# Altium project IDE_44m_to_40f.PrjPcb
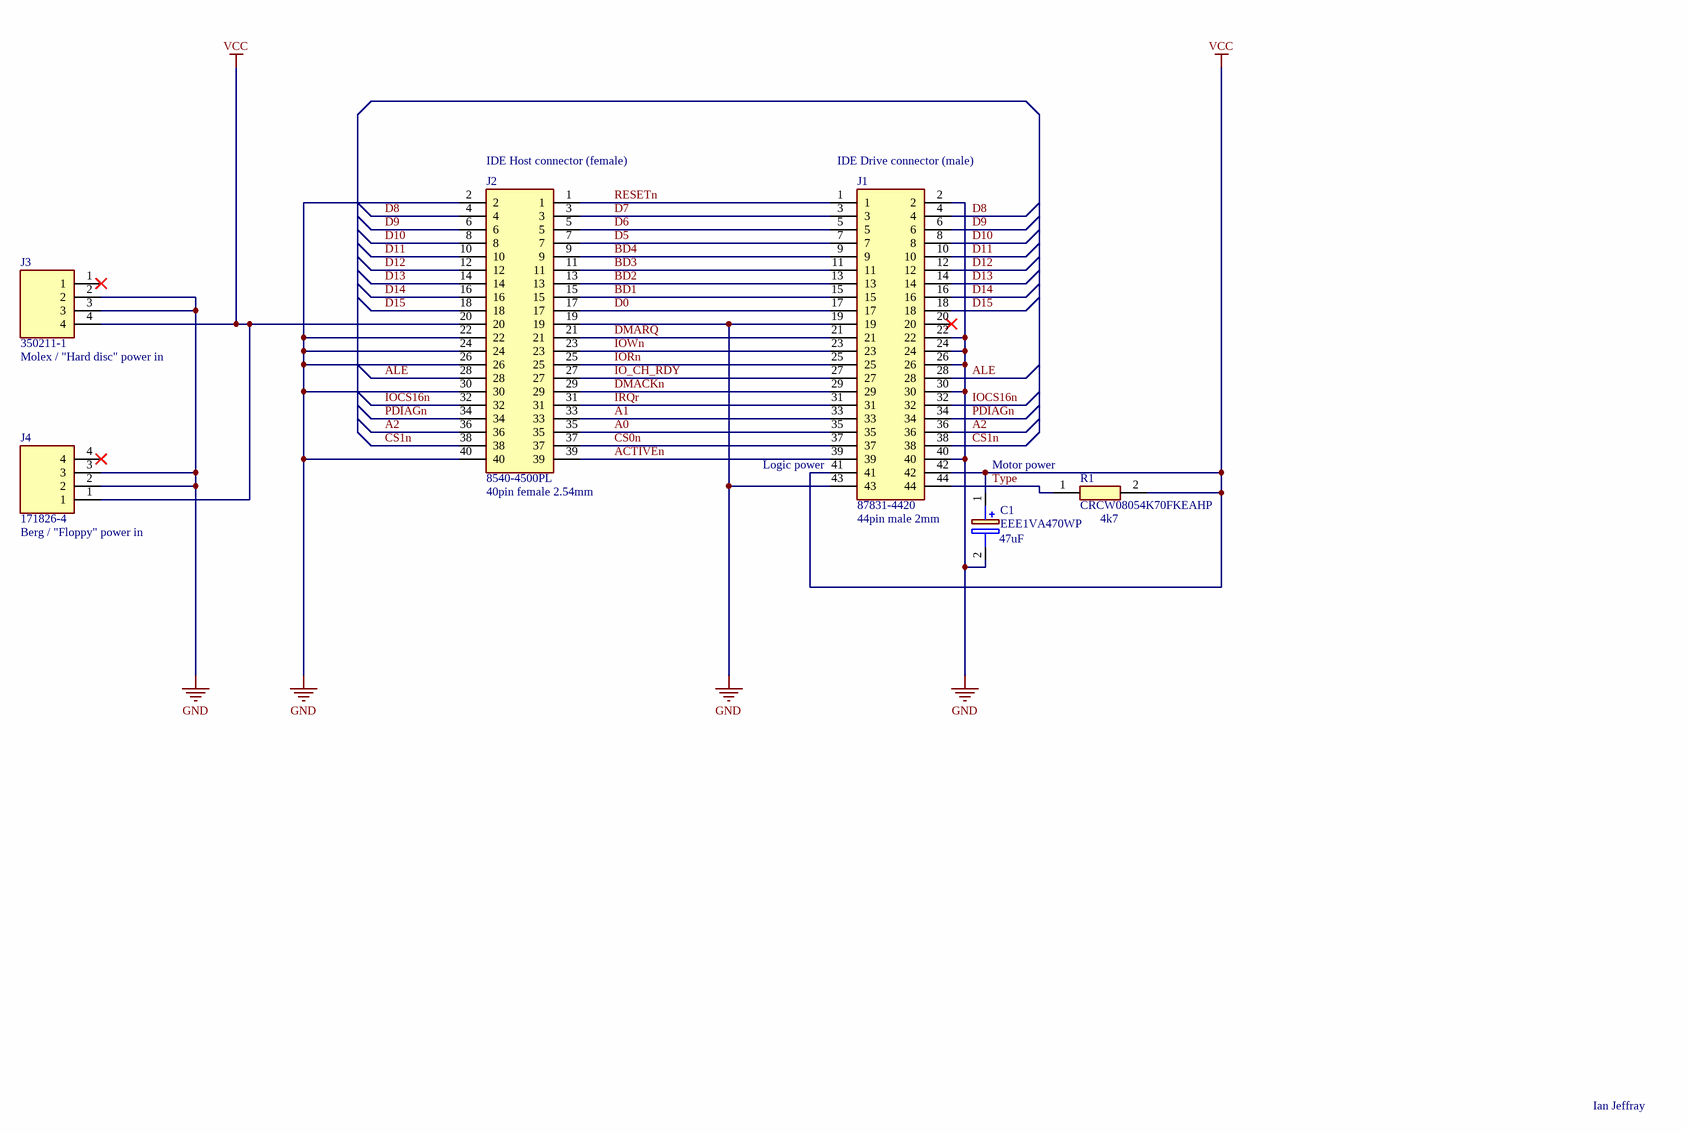
[diagram p0: IDE_44m_to_40f.SchDoc]
Project_Title: IDE 44male to 40female adapter; Sch_ReleaseDate: 20/02/2023; Sch_RevNo: 1
1 sheet, 6 parts. Net scope: global (net labels, ports and power ports of the same name join across sheets).
Board files: IDE_44m_to_40f_left.PcbDoc, IDE_44m_to_40f_right.PcbDoc

## Sheet IDE_44m_to_40f.SchDoc
size A3; SheetNumber: 1; SheetTotal: 1

### Parts
C1  EEE1VA470WP  value 47uF  [EEE1AA101SP]
J1  87831-4420  value 44pin male 2mm  [SHDR44W55P200_2X22_4665X630X640P]
J2  8540-4500PL  value 40pin female 2.54mm  [85404500PL]
J3  350211-1  [3502111]
J4  171826-4  [SHDRRA4W69P0X250_1X4_1000X1350X670P]
R1  CRCW08054K70FKEAHP  value 4k7  [RESC2012X50N]

### Nets
GND: C1.2(-) J1.2 J1.19 J1.22 J1.24 J1.26 J1.30 J1.40 J1.43 J2.2 J2.19 J2.22 J2.24 J2.26 J2.30 J2.40 J3.2 J3.3 J4.2 J4.3
VCC: C1.1(+) J1.41 J1.42 J2.20 J3.4 J4.1 R1.2
A0: J1.35 J2.35
A1: J1.33 J2.33
A2: J1.36 J2.36
ACTIVEn: J1.39 J2.39
ALE: J1.28 J2.28
BD1: J1.15 J2.15
BD2: J1.13 J2.13
BD3: J1.11 J2.11
BD4: J1.9 J2.9
CS0n: J1.37 J2.37
CS1n: J1.38 J2.38
D0: J1.17 J2.17
D5: J1.7 J2.7
D6: J1.5 J2.5
D7: J1.3 J2.3
D8: J1.4 J2.4
D9: J1.6 J2.6
D10: J1.8 J2.8
D11: J1.10 J2.10
D12: J1.12 J2.12
D13: J1.14 J2.14
D14: J1.16 J2.16
D15: J1.18 J2.18
DMACKn: J1.29 J2.29
DMARQ: J1.21 J2.21
IO_CH_RDY: J1.27 J2.27
IOCS16n: J1.32 J2.32
IORn: J1.25 J2.25
IOWn: J1.23 J2.23
IRQr: J1.31 J2.31
PDIAGn: J1.34 J2.34
RESETn: J1.1 J2.1
Type: J1.44 R1.1

Not connected (* = marked no-connect by the designer): J1 20*; J3 1*; J4 4*

### Notes on the sheet
- (near J2) IDE Host connector (female)
- (near J1) IDE Drive connector (male)
- (near J3) Molex / "Hard disc" power in
- (near J1) Logic power
- Motor power
- (near J4) Berg / "Floppy" power in
- Ian Jeffray
- SIZE
- CODION LTD
- DIMENSIONS
- TITLE
- VARIANT
- REVISION
- DATE
- A3
- SHEET
- OF
- FILE
- DRAWN BY

### Library data of the parts
C1 = EEE1VA470WP: Capacitor Polarised; Manufacturer_Name: Panasonic; Datasheet Link: http://industrial.panasonic.com/cdbs/www-data/pdf/RDE0000/ABA0000C1145.pdf; Height: 7.8mm; Manufacturer_Part_Number: EEE1VA470WP
J1 = 87831-4420: Drive connector; Manufacturer_Name: Molex; Datasheet Link: https://datasheet.datasheetarchive.com/originals/distributors/Datasheets-DGA22/2095109.pdf; Height: 6.4mm; Manufacturer_Part_Number: 87831-4420; Mouser Part Number: 538-87831-4420; Mouser Price/Stock: https://www.mouser.co.uk/ProductDetail/Molex/87831-4420?qs=tYx%252BZc2nXqqGnHzye8Wn9w%3D%3D
J2 = 8540-4500PL: Connector; Manufacturer_Name: 3M; Datasheet Link: https://datasheet.datasheetarchive.com/originals/distributors/Datasheets-1/DSA-266.pdf; Height: 10.8mm; Manufacturer_Part_Number: 8540-4500PL; Mouser Part Number: 517-8540-4500PL; Mouser Price/Stock: https://www.mouser.co.uk/ProductDetail/3M-Electronic-Solutions-Division/8540-4500PL?qs=7lbtAbU1WMyb%2F8dgNHAAlg%3D%3D; Arrow Part Number: 8540-4500PL; Arrow Price/Stock: https://www.arrow.com/en/products/8540-4500pl/3m?region=europe
J3 = 350211-1: Alternate power input; Manufacturer_Name: TE Connectivity; Datasheet Link: http://uk.rs-online.com/web/p/products/1638437; Height: 10.29mm; Manufacturer_Part_Number: 350211-1; Mouser Part Number: 571-3502111; Mouser Price/Stock: https://www.mouser.co.uk/ProductDetail/TE-Connectivity-AMP/350211-1?qs=wtYpWE7xRjkLa2TSgKGgng%3D%3D; Arrow Part Number: 350211-1; Arrow Price/Stock: https://www.arrow.com/en/products/350211-1/te-connectivity?region=nac
J4 = 171826-4: Connector; Manufacturer_Name: TE Connectivity; Datasheet Link: https://componentsearchengine.com/Datasheets/2/171826-4.pdf; Height: 6.7mm; Manufacturer_Part_Number: 171826-4; Mouser Part Number: 571-1718264; Mouser Price/Stock: https://www.mouser.co.uk/ProductDetail/TE-Connectivity/171826-4?qs=4hg9R9g9MDt3qYFe2l2pbA%3D%3D; Arrow Part Number: 171826-4; Arrow Price/Stock: https://www.arrow.com/en/products/171826-4/te-connectivity?region=nac
R1 = CRCW08054K70FKEAHP: 4k7 Resistor; Manufacturer_Name: Vishay; Datasheet Link: http://uk.rs-online.com/web/p/products/8123574; Height: 0.5mm; Manufacturer_Part_Number: CRCW08054K70FKEAHP; Mouser Part Number: 71-CRCW08054K70FKEAH; Mouser Price/Stock: https://www.mouser.co.uk/ProductDetail/Vishay-Dale/CRCW08054K70FKEAHP?qs=k2%2FDWSARqgEa%252B2IrxOkJMA%3D%3D; Arrow Part Number: CRCW08054K70FKEAHP; Arrow Price/Stock: https://www.arrow.com/en/products/crcw08054k70fkeahp/vishay?region=nac

## Assembly variants
Pin20power: not fitted J3 J4
Molex_power: not fitted C1 J4
Berg_power: not fitted C1 J3